# Altium schematic sheet 51-2001-01-17_04 Power Module Schematic.SchDoc
size 431 x 279 mm; Organization: ORGANIZATION; Address1: ADDRESS 1; Address2: ADDRESS 2; Address3: ADDRESS 3; Address4: ADDRESS 4; Revision: -; SheetNumber: 4; SheetTotal: 4; ENG_APP_DATE: --/--/--; DSN_APP_DATE: --/--/--; CHK_APP_DATE: --/--/--
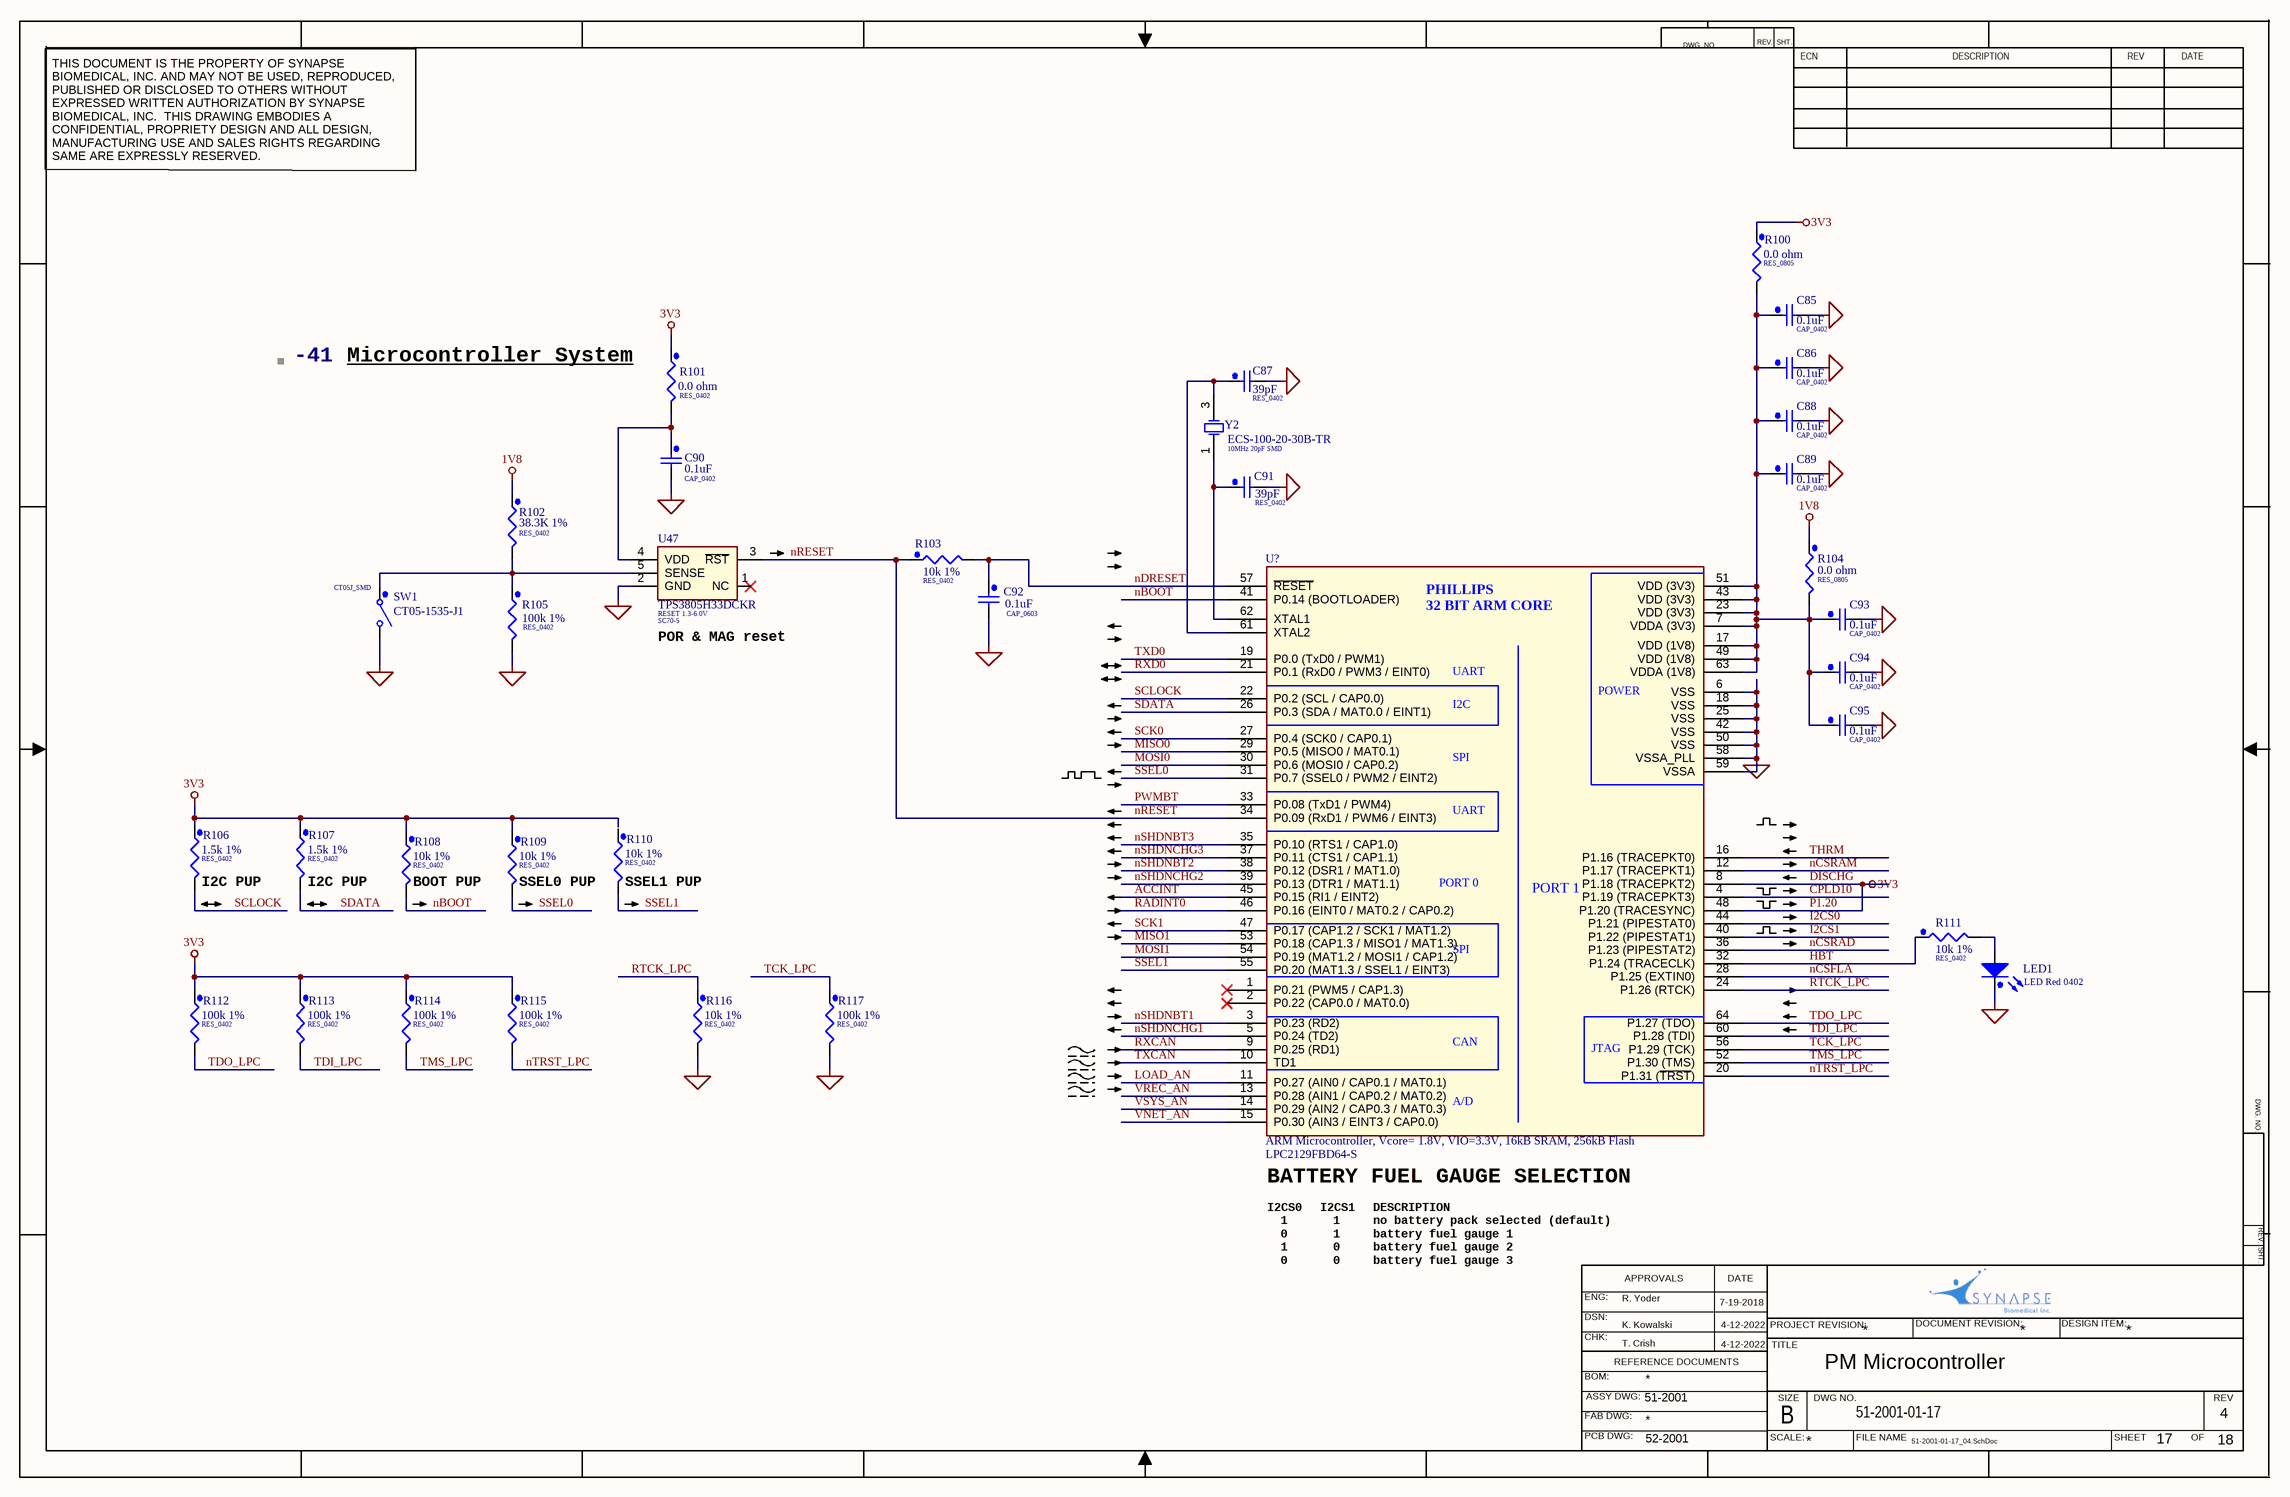
[diagram p0: 51-2001-01-17_04 Power Module Schematic.SchDoc]

## Parts
-41  XDESCRIPTION: Microcontroller System  (hidden comment: BOM_S1)  (graphical)
C85  value 0.1uF  [CAP_0402]  (hidden comment: C_100n_X7R_16_0402_10%)
C86  value 0.1uF  [CAP_0402]  (hidden comment: C_100n_X7R_16_0402_10%)
C87  value 39pF  PackageDescription: RES_0402  [CAP_0402]  (hidden comment: C_39p_C0G_50_0402_5%)
C88  value 0.1uF  [CAP_0402]  (hidden comment: C_100n_X7R_16_0402_10%)
C89  value 0.1uF  [CAP_0402]  (hidden comment: C_100n_X7R_16_0402_10%)
C90  value 0.1uF  [CAP_0402]  (hidden comment: C_100n_X7R_16_0402_10%)
C91  value 39pF  PackageDescription: RES_0402  [CAP_0402]  (hidden comment: C_39p_C0G_50_0402_5%)
C92  value 0.1uF  [CAP_0603]  (hidden comment: C_100n_X7R_50_0603_10%)
C93  value 0.1uF  [CAP_0402]  (hidden comment: C_100n_X7R_16_0402_10%)
C94  value 0.1uF  [CAP_0402]  (hidden comment: C_100n_X7R_16_0402_10%)
C95  value 0.1uF  [CAP_0402]  (hidden comment: C_100n_X7R_16_0402_10%)
LED1  LED Red 0402  [LED_0402_RED]
R100  value 0.0 ohm  [RES_0805]  (hidden comment: R_0_0805)
R101  value 0.0 ohm  [RES_0402]  (hidden comment: R_0_0402)
R102  value 38.3K 1%  [RES_0402]  (hidden comment: R_38k3_0402)
R103  value 10k 1%  [RES_0402]  (hidden comment: R_10k_0402)
R104  value 0.0 ohm  [RES_0805]  (hidden comment: R_0_0805)
R105  value 100k 1%  [RES_0402]  (hidden comment: R_100k_0402)
R106  value 1.5k 1%  [RES_0402]  (hidden comment: R_1.5k_0402)
R107  value 1.5k 1%  [RES_0402]  (hidden comment: R_1.5k_0402)
R108  value 10k 1%  [RES_0402]  (hidden comment: R_10k_0402)
R109  value 10k 1%  [RES_0402]  (hidden comment: R_10k_0402)
R110  value 10k 1%  [RES_0402]  (hidden comment: R_10k_0402)
R111  value 10k 1%  [RES_0402]  (hidden comment: R_10k_0402)
R112  value 100k 1%  [RES_0402]  (hidden comment: R_100k_0402)
R113  value 100k 1%  [RES_0402]  (hidden comment: R_100k_0402)
R114  value 100k 1%  [RES_0402]  (hidden comment: R_100k_0402)
R115  value 100k 1%  [RES_0402]  (hidden comment: R_100k_0402)
R116  value 10k 1%  [RES_0402]  (hidden comment: R_10k_0402)
R117  value 100k 1%  [RES_0402]  (hidden comment: R_100k_0402)
SW1  PackageDescription: CT05J_SMD  (hidden comment: Reed SW)
U47  RESET 1.3-6.0V  MPN: TPS3805H33DCKR  [SC70-5]
U?  ARM Microcontroller, Vcore= 1.8V, VIO=3.3V, 16kB SRAM, 256kB Flash  [SOT314-2_N]
Y2  10MHz 20pF SMD  [ECX-53B]

## Nets
1V8: R102.1 R104.1
DISCHG: R100.1 R101.1 R106.1 R107.1 R108.1 R109.1 R112.1 R113.1 R114.1 R115.1 U?.8(P1.18_(TRACEPKT2)) U?.48(P1.20_(TRACESYNC))  [also labelled 3V3, P1.20]
GND: C85.2 C86.2 C87.2 C88.2 C89.2 C90.2 C91.2 C92.2 C93.2 C94.2 C95.2 LED1.1(C) R105.2 R116.2 R117.2 SW1.2(NO) U47.2(GND) U?.6(VSS) U?.18(VSS) U?.25(VSS) U?.42(VSS) U?.50(VSS) U?.58(VSSA_PLL) U?.59(VSSA)
ACCINT: U?.45(P0.15_(RI1_/_EINT2))
CPLD10: U?.4(P1.19_(TRACEPKT3))
HBT: R111.1 U?.32(P1.24_(TRACECLK))
I2CS0: U?.44(P1.21_(PIPESTAT0))
I2CS1: U?.40(P1.22_(PIPESTAT1))
LOAD_AN: U?.11(P0.27_(AIN0_/_CAP0.1_/_MAT0.1))
MISO0: U?.29(P0.5_(MISO0_/_MAT0.1))
MISO1: U?.53(P0.18_(CAP1.3_/_MISO1_/_MAT1.3))
MOSI0: U?.30(P0.6_(MOSI0_/_CAP0.2))
MOSI1: U?.54(P0.19_(MAT1.2_/_MOSI1_/_CAP1.2))
nBOOT: R108.2 U?.41(P0.14_(BOOTLOADER))
nCSFLA: U?.28(P1.25_(EXTIN0))
nCSRAD: U?.36(P1.23_(PIPESTAT2))
nCSRAM: U?.12(P1.17_(TRACEPKT1))
nDRESET: C92.1 R103.2 U?.57(~{RESET})
nRESET: R103.1 U47.3(~{RST}) U?.34(P0.09_(RxD1_/_PWM6_/_EINT3))
nSHDNBT1: U?.3(P0.23_(RD2))
nSHDNBT2: U?.38(P0.12_(DSR1_/_MAT1.0))
nSHDNBT3: U?.35(P0.10_(RTS1_/_CAP1.0))
nSHDNCHG1: U?.5(P0.24_(TD2))
nSHDNCHG2: U?.39(P0.13_(DTR1_/_MAT1.1))
nSHDNCHG3: U?.37(P0.11_(CTS1_/_CAP1.1))
nTRST_LPC: R115.2 U?.20(P1.31_(~{TRST}))
PWMBT: U?.33(P0.08_(TxD1_/_PWM4))
RADINT0: U?.46(P0.16_(EINT0_/_MAT0.2_/_CAP0.2))
RTCK_LPC: R116.1 U?.24(P1.26_(RTCK))
RXCAN: U?.9(P0.25_(RD1))
RXD0: U?.21(P0.1_(RxD0_/_PWM3_/_EINT0))
SCK0: U?.27(P0.4_(SCK0_/_CAP0.1))
SCK1: U?.47(P0.17_(CAP1.2_/_SCK1_/_MAT1.2))
SCLOCK: R106.2 U?.22(P0.2_(SCL_/_CAP0.0))
SDATA: R107.2 U?.26(P0.3_(SDA_/_MAT0.0_/_EINT1))
SSEL0: R109.2 U?.31(P0.7_(SSEL0_/_PWM2_/_EINT2))
SSEL1: R110.2 U?.55(P0.20_(MAT1.3_/_SSEL1_/_EINT3))
TCK_LPC: R117.1 U?.56(P1.29_(TCK))
TDI_LPC: R113.2 U?.60(P1.28_(TDI))
TDO_LPC: R112.2 U?.64(P1.27_(TDO))
THRM: U?.16(P1.16_(TRACEPKT0))
TMS_LPC: R114.2 U?.52(P1.30_(TMS))
TXCAN: U?.10(TD1)
TXD0: U?.19(P0.0_(TxD0_/_PWM1))
VNET_AN: U?.15(P0.30_(AIN3_/_EINT3_/_CAP0.0))
VREC_AN: U?.13(P0.28_(AIN1_/_CAP0.2_/_MAT0.2))
VSYS_AN: U?.14(P0.29_(AIN2_/_CAP0.3_/_MAT0.3))
NetC85_1: C85.1 C86.1 C88.1 C89.1 C93.1 C94.1 C95.1 R100.2 R104.2 U?.7(VDDA_(3V3)) U?.17(VDD_(1V8)) U?.23(VDD_(3V3)) U?.43(VDD_(3V3)) U?.49(VDD_(1V8)) U?.51(VDD_(3V3)) U?.63(VDDA_(1V8))
NetC87_1: C87.1 U?.61(XTAL2) Y2.3(OSC2)
NetC90_1: C90.1 R101.2 U47.4(VDD)
NetC91_1: C91.1 U?.62(XTAL1) Y2.1(OSC1)
NetLED1_2: LED1.2(A) R111.2
NetR102_2: R102.2 R105.1 SW1.1(COMMON) U47.5(SENSE)

Not connected (* = marked no-connect by the designer): R110 1; U47 1(NC)*; U? 1(P0.21_(PWM5_/_CAP1.3))* 2(P0.22_(CAP0.0_/_MAT0.0))*

## Notes on the sheet
- DWG. NO.
- REV.
- SHT.
- ECN
- DESCRIPTION
- REV
- DATE
- THIS DOCUMENT IS THE PROPERTY OF SYNAPSE BIOMEDICAL, INC. AND MAY NOT BE USED, REPRODUCED, PUBLISHED OR DISCLOSED TO OTHERS WITHOUT EXPRESSED WRITTEN AUTHORIZATION BY SYNAPSE BIOMEDICAL, INC.  THIS DRAWING EMBODIES A CONFIDENTIAL, PROPRIETY DESIGN AND ALL DESIGN, MANUFACTURING USE AND SALES RIGHTS REGARDING SAME ARE EXPRESSLY RESERVED.
- (near U47) POR & MAG reset
- (near R106) I2C PUP
- (near R107) I2C PUP
- (near R108) BOOT PUP
- (near R109) SSEL0 PUP
- (near R110) SSEL1 PUP
- I2CS0
- (near U?) BATTERY FUEL GAUGE SELECTION
- 1
- 0
- I2CS1
- no battery pack selected (default)
- battery fuel gauge 1
- battery fuel gauge 3
- battery fuel gauge 2
- ENG:
- R. Yoder
- APPROVALS
- 7-19-2018
- DSN:
- CHK:
- REFERENCE DOCUMENTS
- K. Kowalski
- T. Crish
- 4-12-2022
- PROJECT REVISION:
- TITLE
- PM Microcontroller
- *
- DOCUMENT REVISION:
- DESIGN ITEM:
- BOM:
- FAB DWG:
- PCB DWG:
- ASSY DWG:
- 51-2001
- SCALE:
- SIZE
- B
- DWG NO.
- 51-2001-01-17
- FILE NAME
- SHEET
- OF
- 4
- 52-2001
- 51-2001-01-17_04.SchDoc
- 17
- 18
- (in symbol LPC2129FBD64-S) PHILLIPS / 32 BIT ARM CORE; UART; POWER; I2C; SPI; PORT 0; PORT 1; CAN; JTAG; A/D

## Library data of the parts
-41 = BOM_S1: BOM item small graphic
C85 C86 C88-C90 C93-C95 = GRM155R71C104KA88D: 0.1uF, 16V, X7R, 0402, RoHS; MFR: Murata; SBI: 53-0040-1; PackageDescription: CAP_0402; Supplier 1: Digi-Key; Supplier Part Number 1: 490-3261-2-ND; MPN: GRM155R71C104KA88D
C87 C91 = C0402C390J5GACTU: 39pF, 50V, C0G, 5%, 0402, RoHS; MFR: Murata Electronics North America; MPN: GRM1555C1H390JA01D; SBI: 53-0041-8; Supplier 1: Digi-Key; Supplier Part Number 1: 490-5871-6-ND
C92 = C0603C104K5RACTU: 0.1uF, 50V, X7R, 10%, 0603, RoHS; MFR: Murata Electronics North America; MPN: GRM188R71H104KA93D; SBI: 53-0085; PackageDescription: CAP_0603; Supplier 1: Digi-Key; Supplier Part Number 1: 490-1519-6-ND
LED1 = SML-LX0402SIC-TR: LED, Red, 0402, 20mA ,2V, 140mcd, RoHS; MFR: Lumex; SBI: 53-0035; PackageDescription: 0402; Supplier 1: Digi-Key; Supplier Part Number 1: 67-1878-1-ND; MPN: SML-LX0402SIC-TR
R100 R104 = MCR10EZPJ000: 0.0 ohm, 1/8W, 0805, RoHS; MFR: Vishay Dale; MPN: CRCW08050000Z0EA; SBI: 53-0088; PackageDescription: RES_0805; Supplier 1: Digi-Key; Supplier Part Number 1: 541-0.0ADKR-ND
R101 = MCR01MZPJ000: 0.0 ohm, 1/16W, 0402, RoHS; MFR: Vishay Dale; MPN: CRCW04021K00FKED; SBI: 53-0048; PackageDescription: RES_0402; Supplier 1: Digi-Key; Supplier Part Number 1: 541-1.00KLDKR-ND
R102 = CRCW040238K3FKED: 38.3k ohm, 1%, 1/16W, 0402, RoHS; MFR: Vishay; SBI: 53-0049-35; PackageDescription: RES_0402; Supplier 1: Digi-Key; Supplier Part Number 1: 541-38.3KLDKR-ND; MPN: CRCW040238K3FKED
R103 R108-R111 R116 = MCR01MZPF1002: 10.0k ohm, 1%, 1/16W, smd, 0402, RoHS; MFR: Vishay Dale; MPN: CRCW040210K0FKED; PackageDescription: RES_0402; Supplier 1: Digi-Key; Supplier Part Number 1: 541-10.0KLDKR-ND
R105 R112-R115 R117 = MCR01MZPF1003: 100k ohm, 1%, 1/16W, smd, 0402, RoHS; MFR: Vishay Dale; MPN: CRCW0402100KFKED; SBI: 53-0049-7; PackageDescription: RES_0402; Supplier 1: Digi-Key; Supplier Part Number 1: 541-100KLDKR-ND
R106 R107 = MCR01MZPF1002: 1.5k ohm, 1%, 1/16W, smd, 0402, RoHS; MFR: Vishay Dale; MPN: CRCW04021K50FKEDHP; PackageDescription: RES_0402; Supplier 1: Digi-Key; Supplier Part Number 1: 541-1.50KYCT-ND
SW1 = CT05-1535-J1: Reed SW, RoHS; MFR: Coto Technology; SBI: 54-0085; Supplier Part Number 1: 306-1151-1-ND; Supplier 1: Digi-Key; MPN: CT05-1535-J1
U47 = TPS3805H33: Voltage detector Reset, SC70-5, RoHS; MFR: Texas Instruments; SBI: 54-0060; PackageDescription: SC70-5; Supplier 1: Digi-Key; Supplier Part Number 1: 296-13407-1-ND
U? = LPC2129FBD64-S: Phillips LPC2129FBD64 32-bit ARM, Vcore= 1.8V, VIO=3.3V, QFP; Manufacturer: Philips; Value: uP; Supplier 1: Digi-Key; Supplier Part Number 1: 568-1225-ND; PackageDescription: QFP64-9; ManufacturerPN: LPC2129FBD64-S
Y2 = ECS-100-20-30B-TR: Crystal 10MHz 20pF HC-49US; Manufacturer: ECS; SBI: 54-0110; PackageDescription: CRYSTAL 10.000 MHZ 20PF SMD, 5mm x 3.2mm; ManufacturerPN: ECS-100-20-30B-TR; Supplier 1: Digi-Key; Supplier Part Number 1: XC1117CT-ND; MFR: ECS; MPN: ECS-100-20-30B-TR